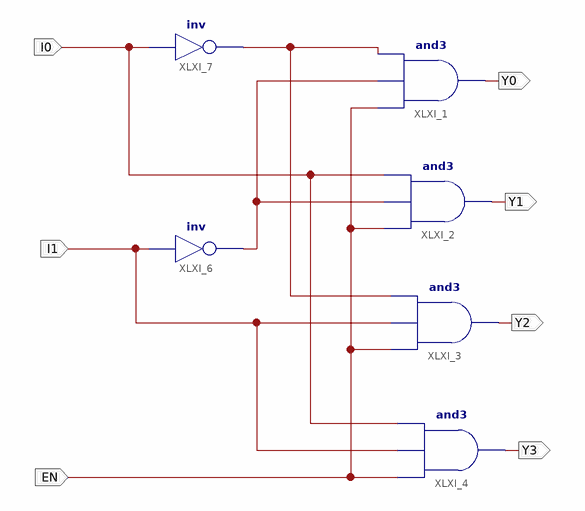
[diagram p0: schematic sheet 1]
// Xilinx ISE schematic Decoder_2_to_4.sch (spartan3e) as structural Verilog: 6 symbols, 7 ports
module Decoder_2_to_4 (
  input  l0,
  input  l1,
  input  EN,
  output Y0,
  output Y1,
  output Y2,
  output Y3
);

  wire XLXN_4, XLXN_9;

  and XLXI_1 (Y0, EN, XLXN_9, XLXN_4);
  and XLXI_2 (Y1, EN, XLXN_9, l0);
  and XLXI_3 (Y2, EN, l1, XLXN_4);
  and XLXI_4 (Y3, EN, l1, l0);
  not XLXI_6 (XLXN_9, l1);
  not XLXI_7 (XLXN_4, l0);
endmodule
